# EAGLE schematic driver_board (EAGLE 6.1)

## Sheet 1 of 7: STM1_Mikrokontroler
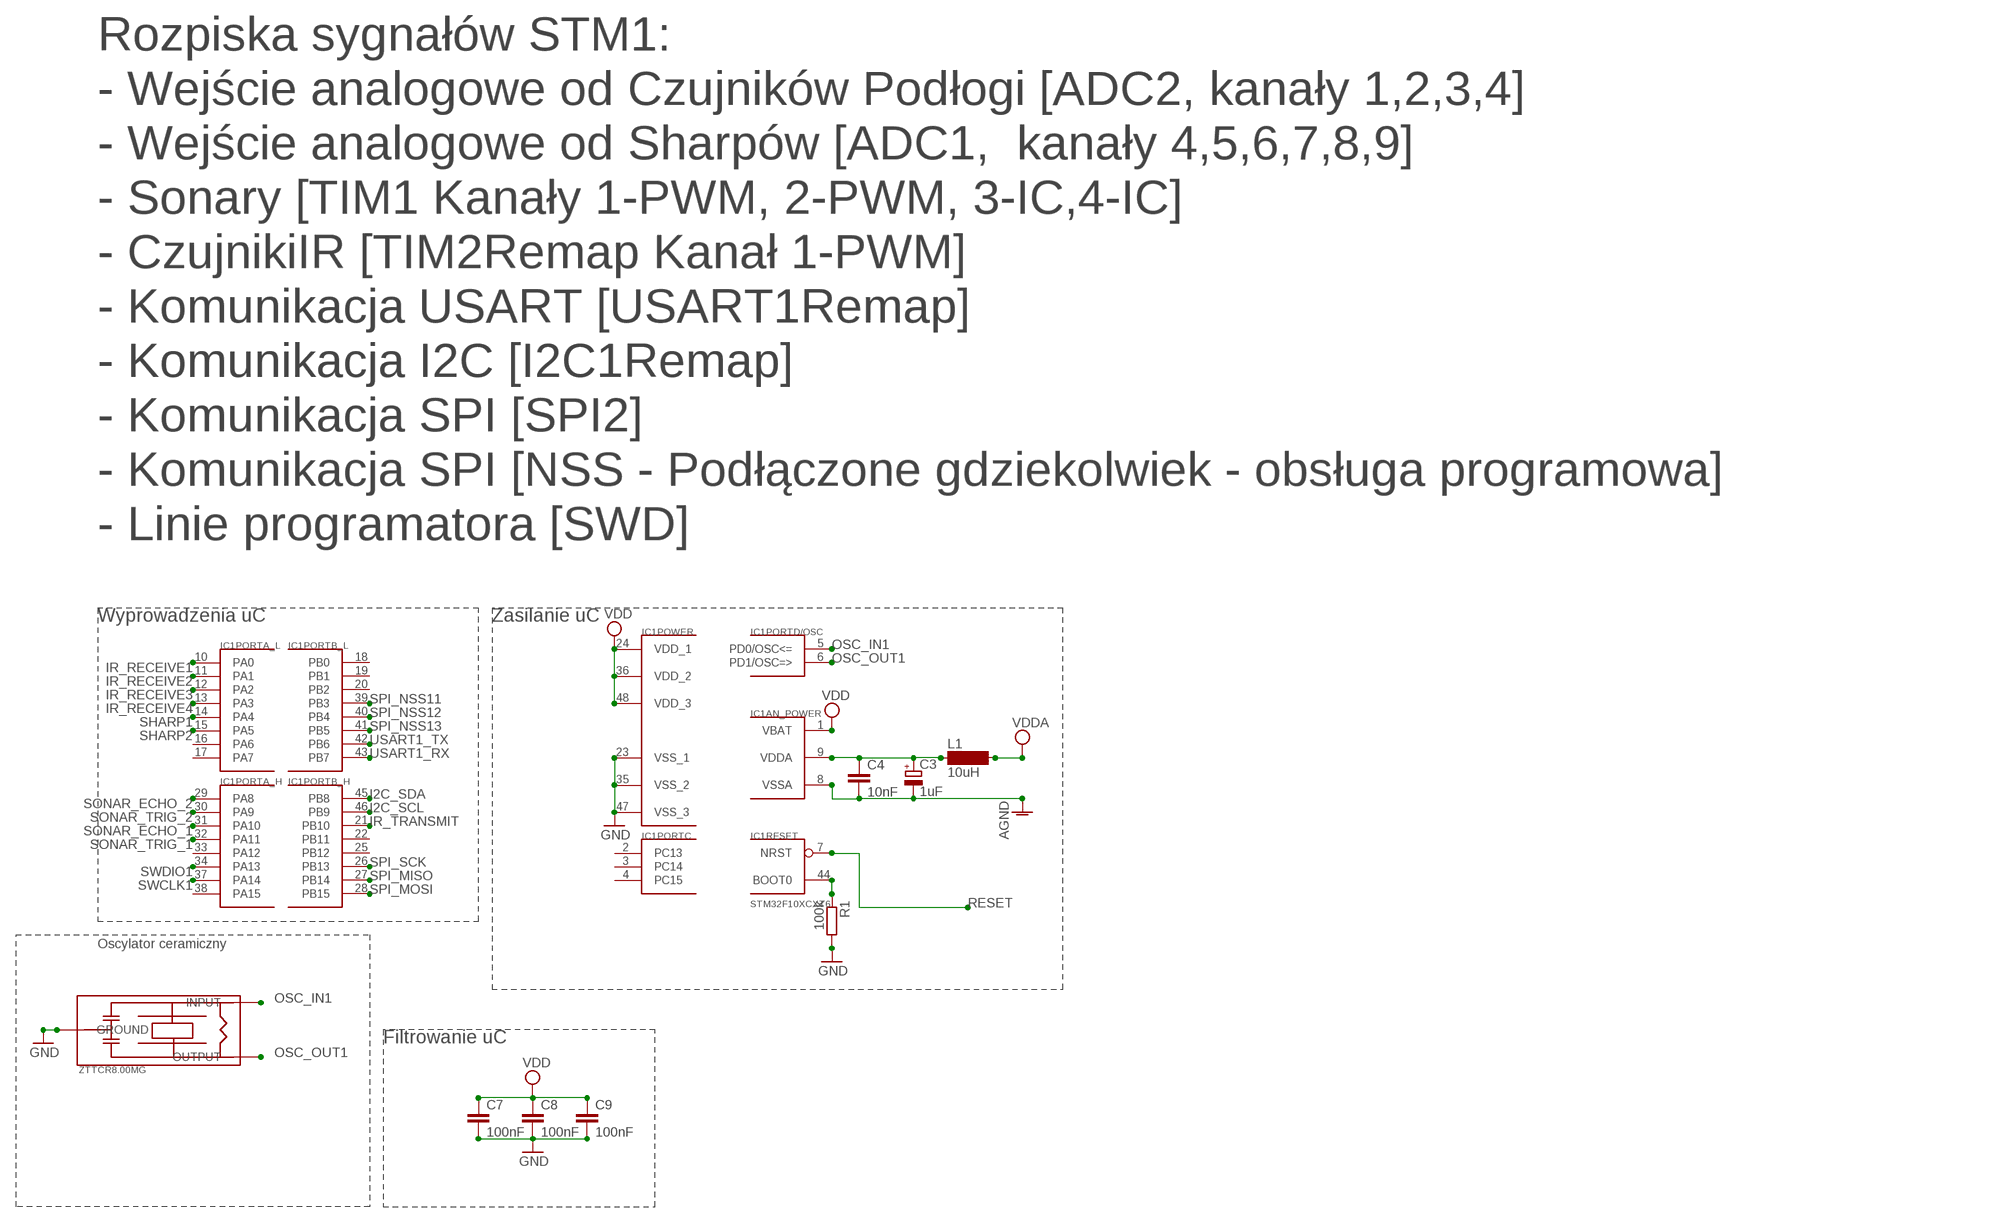
[diagram p0: schematic, sheet 1]

### Parts
C3  1uF  CPOL-EUSMCA  [SMC_A]
C4  10nF  C-EUC0805  [C0805]
C7  100nF  C-EUC0805  [C0805]
C8  100nF  C-EUC0805  [C0805]
C9  100nF  C-EUC0805  [C0805]
IC1  STM32F10XCXT6  [TQFP48]
L1  10uH  SM-1206  [SM-1206]
R1  100k  R-EU_R0805  [R0805]
U$7  ZTTCR8.00MG  [ZTTCR8.00MG]

### Nets
AGND: C3.- C4.2 IC1.8(AN_POWER:VSSA) ; also sheet 3,7
GND: C7.2 C8.2 C9.2 IC1.23(POWER:VSS_1) IC1.35(POWER:VSS_2) IC1.47(POWER:VSS_3) R1.2 U$7.GROUND ; also sheet 2,3,4,5,6,7
I2C_SCL: IC1.46(PORTB_H:PB9) ; also sheet 3,6
I2C_SDA: IC1.45(PORTB_H:PB8) ; also sheet 3,6
IR_RECEIVE1: IC1.10(PORTA_L:PA0) ; also sheet 4
IR_RECEIVE2: IC1.11(PORTA_L:PA1) ; also sheet 4
IR_RECEIVE3: IC1.12(PORTA_L:PA2) ; also sheet 4
IR_RECEIVE4: IC1.13(PORTA_L:PA3) ; also sheet 4
IR_TRANSMIT: IC1.21(PORTB_H:PB10) ; also sheet 4
N$4: IC1.44(RESET:BOOT0) R1.1
N$5: C3.+ C4.1 IC1.9(AN_POWER:VDDA) L1.1
OSC_IN1: IC1.5(PORTD/OSC:PD0/OSC<=) U$7.INPUT
OSC_OUT1: IC1.6(PORTD/OSC:PD1/OSC=>) U$7.OUTPUT
RESET: IC1.7(RESET:NRST) ; also sheet 3
SHARP1: IC1.14(PORTA_L:PA4) ; also sheet 2
SHARP2: IC1.15(PORTA_L:PA5) ; also sheet 2
SONAR_ECHO_1: IC1.31(PORTA_H:PA10) ; also sheet 2
SONAR_ECHO_2: IC1.29(PORTA_H:PA8) ; also sheet 2
SONAR_TRIG_1: IC1.32(PORTA_H:PA11) ; also sheet 2
SONAR_TRIG_2: IC1.30(PORTA_H:PA9) ; also sheet 2
SPI_MISO: IC1.27(PORTB_H:PB14) ; also sheet 3,5,6
SPI_MOSI: IC1.28(PORTB_H:PB15) ; also sheet 3,5,6
SPI_NSS11: IC1.39(PORTB_L:PB3) ; also sheet 5
SPI_NSS12: IC1.40(PORTB_L:PB4) ; also sheet 6
SPI_NSS13: IC1.41(PORTB_L:PB5) ; also sheet 6
SPI_SCK: IC1.26(PORTB_H:PB13) ; also sheet 3,5,6
SWCLK1: IC1.37(PORTA_H:PA14) ; also sheet 7
SWDIO1: IC1.34(PORTA_H:PA13) ; also sheet 7
USART1_RX: IC1.43(PORTB_L:PB7) ; also sheet 6
USART1_TX: IC1.42(PORTB_L:PB6) ; also sheet 6
VDD: C7.1 C8.1 C9.1 IC1.1(AN_POWER:VBAT) IC1.24(POWER:VDD_1) IC1.36(POWER:VDD_2) IC1.48(POWER:VDD_3) ; also sheet 3,4,6,7
VDDA: L1.2 ; also sheet 7
Unconnected: IC1.2(PORTC:PC13) IC1.3(PORTC:PC14) IC1.4(PORTC:PC15) IC1.16(PORTA_L:PA6) IC1.17(PORTA_L:PA7) IC1.18(PORTB_L:PB0) IC1.19(PORTB_L:PB1) IC1.20(PORTB_L:PB2) IC1.22(PORTB_H:PB11) IC1.25(PORTB_H:PB12) IC1.33(PORTA_H:PA12) IC1.38(PORTA_H:PA15)

### Notes on the sheet
- Rozpiska sygnałów STM1:
- - Wejście analogowe od Czujników Podłogi [ADC2, kanały 1,2,3,4]
- - Wejście analogowe od Sharpów [ADC1,  kanały 4,5,6,7,8,9]
- - Sonary [TIM1 Kanały 1-PWM, 2-PWM, 3-IC,4-IC]
- - CzujnikiIR [TIM2Remap Kanał 1-PWM]
- - Komunikacja USART [USART1Remap]
- - Komunikacja I2C [I2C1Remap]
- - Komunikacja SPI [SPI2]
- - Komunikacja SPI [NSS - Podłączone gdziekolwiek - obsługa programowa]
- - Linie programatora [SWD]
- Wyprowadzenia uC | Zasilanie uC
- Oscylator ceramiczny
- Filtrowanie uC

## Sheet 2 of 7: STM1_Sonary
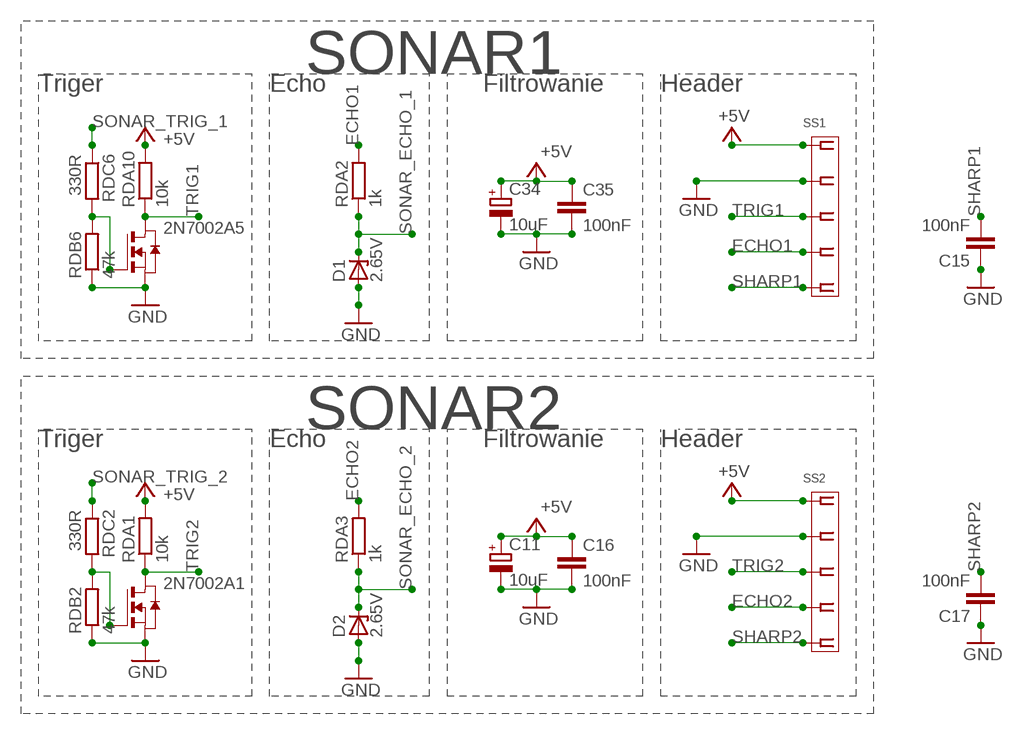
[diagram p1: schematic, sheet 2]

### Parts
2N7002A1  NMOSSOT23  [SOT-23]
2N7002A5  NMOSSOT23  [SOT-23]
C11  10uF  CPOL-EUSMCA  [SMC_A]
C15  100nF  C-EUC0805  [C0805]
C16  100nF  C-EUC0805  [C0805]
C17  100nF  C-EUC0805  [C0805]
C34  10uF  CPOL-EUSMCA  [SMC_A]
C35  100nF  C-EUC0805  [C0805]
D1  2.65V  ZENER-DIODESOD80C  [SOD80C]
D2  2.65V  ZENER-DIODESOD80C  [SOD80C]
RDA1  10k  R-EU_R0805  [R0805]
RDA2  1k  R-EU_R0805  [R0805]
RDA3  1k  R-EU_R0805  [R0805]
RDA10  10k  R-EU_R0805  [R0805]
RDB2  47k  R-EU_R0805  [R0805]
RDB6  47k  R-EU_R0805  [R0805]
RDC2  330R  R-EU_R0805  [R0805]
RDC6  330R  R-EU_R0805  [R0805]
SS1  MOLEX-5268-05  [MOLEX-5268-05]
SS2  MOLEX-5268-05  [MOLEX-5268-05]

### Nets
+5V: C11.+ C16.1 C34.+ C35.1 RDA1.2 RDA10.2 SS1.P$1 SS2.P$1 ; also sheet 3,5,7
ECHO1: RDA2.2 SS1.P$4
ECHO2: RDA3.2 SS2.P$4
GND: 2N7002A1.2(S) 2N7002A5.2(S) C11.- C15.1 C16.2 C17.1 C34.- C35.2 D1.A D2.A RDB2.1 RDB6.1 SS1.P$2 SS2.P$2 ; also sheet 1,3,4,5,6,7
N$2: 2N7002A5.3(G) RDB6.2 RDC6.2
N$9: 2N7002A1.3(G) RDB2.2 RDC2.2
SHARP1: C15.2 SS1.P$5 ; also sheet 1
SHARP2: C17.2 SS2.P$5 ; also sheet 1
SONAR_ECHO_1: D1.C RDA2.1 ; also sheet 1
SONAR_ECHO_2: D2.C RDA3.1 ; also sheet 1
SONAR_TRIG_1: RDC6.1 ; also sheet 1
SONAR_TRIG_2: RDC2.1 ; also sheet 1
TRIG1: 2N7002A5.1(D) RDA10.1 SS1.P$3
TRIG2: 2N7002A1.1(D) RDA1.1 SS2.P$3

### Notes on the sheet
- SONAR1
- Triger | Echo | Filtrowanie | Header
- SONAR2
- Triger | Echo | Filtrowanie | Header

## Sheet 3 of 7: STM2_Mikrokontroler
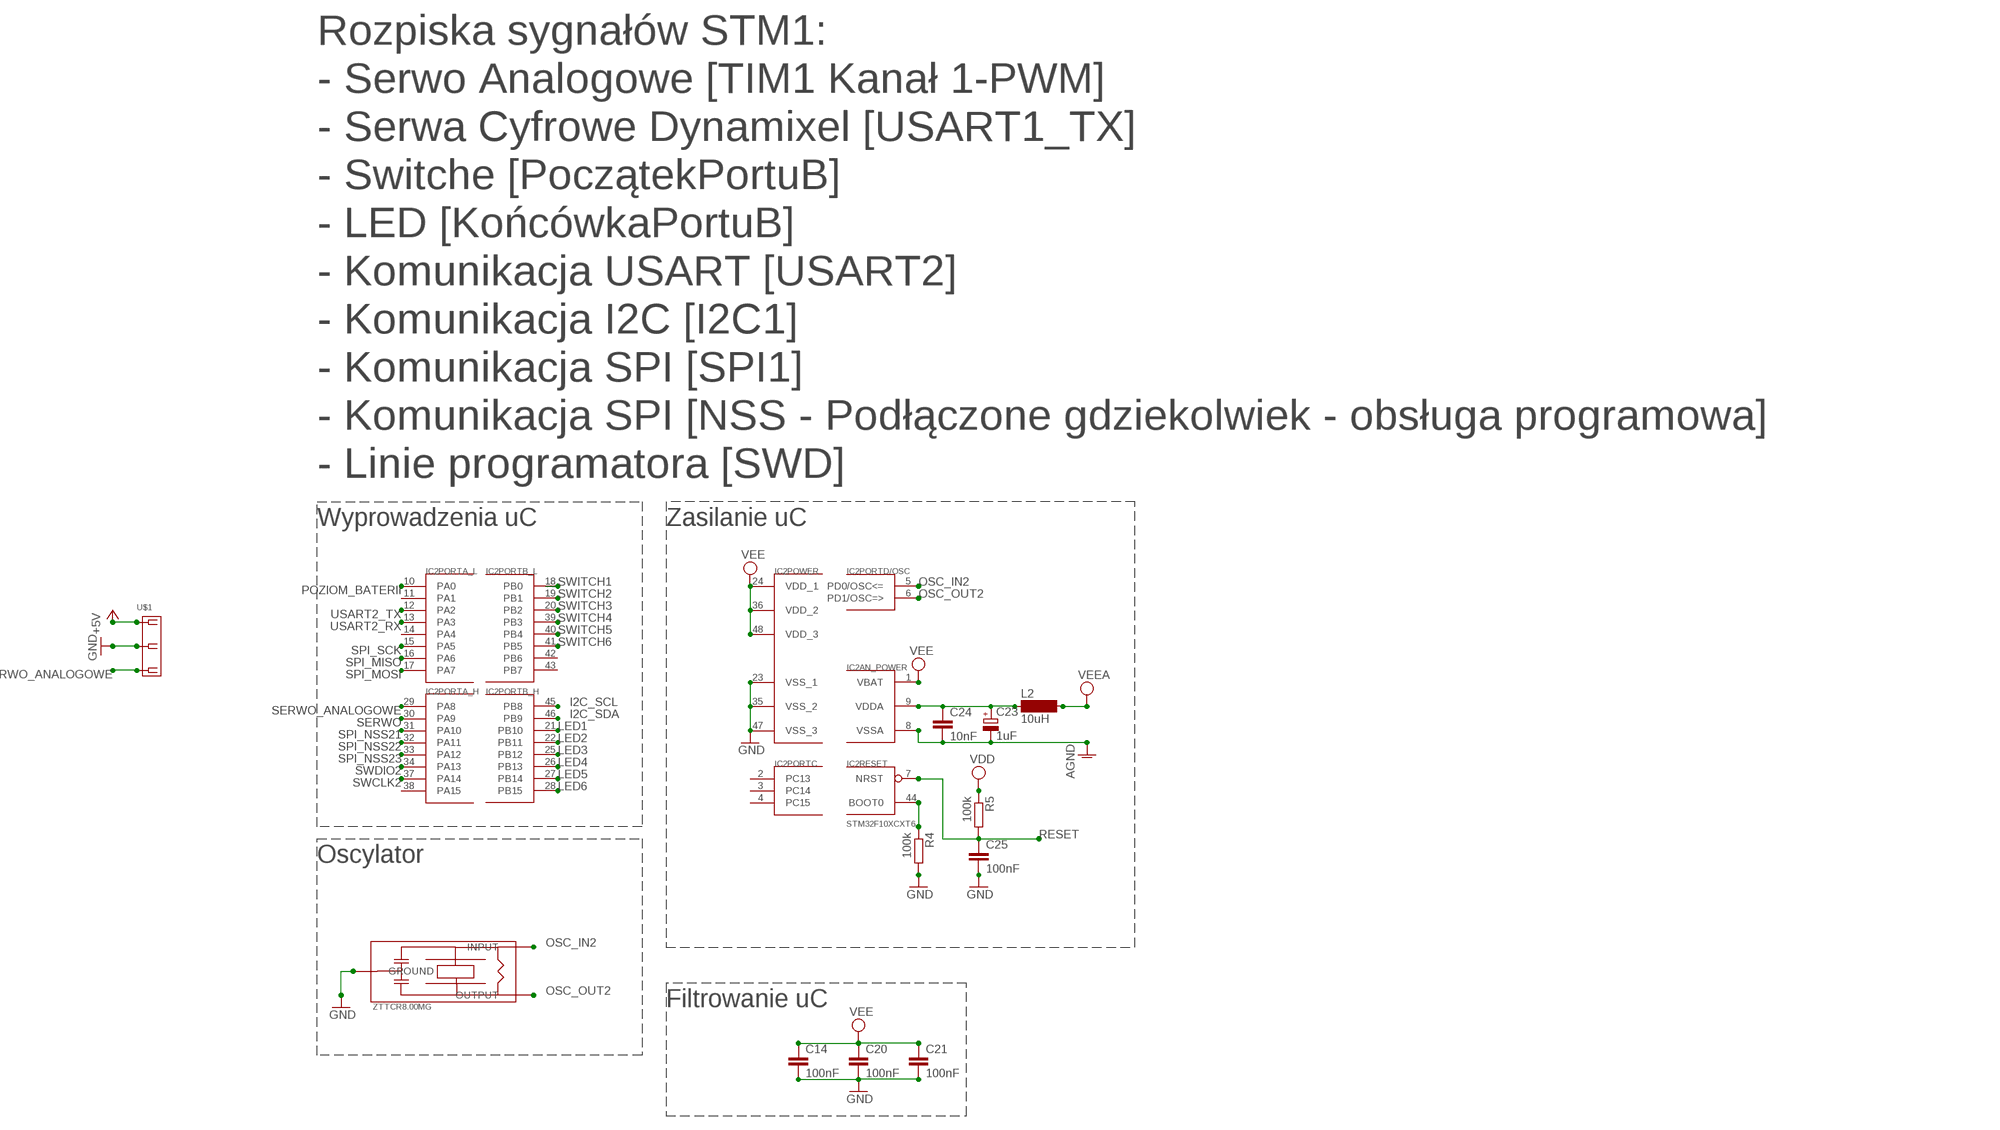
[diagram p2: schematic, sheet 3]

### Parts
C14  100nF  C-EUC0805  [C0805]
C20  100nF  C-EUC0805  [C0805]
C21  100nF  C-EUC0805  [C0805]
C23  1uF  CPOL-EUSMCA  [SMC_A]
C24  10nF  C-EUC0805  [C0805]
C25  100nF  C-EUC0805  [C0805]
IC2  STM32F10XCXT6  [TQFP48]
L2  10uH  SM-1206  [SM-1206]
R4  100k  R-EU_R0805  [R0805]
R5  100k  R-EU_R0805  [R0805]
U$1  MOLEX-5268-03  [MOLEX-5268-03]
U$8  ZTTCR8.00MG  [ZTTCR8.00MG]

### Nets
+5V: U$1.P$1 ; also sheet 2,5,7
AGND: C23.- C24.2 IC2.8(AN_POWER:VSSA) ; also sheet 1,7
GND: C14.2 C20.2 C21.2 C25.2 IC2.23(POWER:VSS_1) IC2.35(POWER:VSS_2) IC2.47(POWER:VSS_3) R4.2 U$1.P$2 U$8.GROUND ; also sheet 1,2,4,5,6,7
I2C_SCL: IC2.45(PORTB_H:PB8) ; also sheet 1,6
I2C_SDA: IC2.46(PORTB_H:PB9) ; also sheet 1,6
LED1: IC2.21(PORTB_H:PB10) ; also sheet 5
LED2: IC2.22(PORTB_H:PB11) ; also sheet 5
LED3: IC2.25(PORTB_H:PB12) ; also sheet 5
LED4: IC2.26(PORTB_H:PB13) ; also sheet 5
LED5: IC2.27(PORTB_H:PB14) ; also sheet 5
LED6: IC2.28(PORTB_H:PB15) ; also sheet 5
N$6: C23.+ C24.1 IC2.9(AN_POWER:VDDA) L2.1
N$7: IC2.44(RESET:BOOT0) R4.1
OSC_IN2: IC2.5(PORTD/OSC:PD0/OSC<=) U$8.INPUT
OSC_OUT2: IC2.6(PORTD/OSC:PD1/OSC=>) U$8.OUTPUT
POZIOM_BATERII: IC2.10(PORTA_L:PA0) ; also sheet 7
RESET: C25.1 IC2.7(RESET:NRST) R5.2 ; also sheet 1
SERWO: IC2.30(PORTA_H:PA9) ; also sheet 5
SERWO_ANALOGOWE: IC2.29(PORTA_H:PA8) U$1.P$3
SPI_MISO: IC2.16(PORTA_L:PA6) ; also sheet 1,5,6
SPI_MOSI: IC2.17(PORTA_L:PA7) ; also sheet 1,5,6
SPI_NSS21: IC2.31(PORTA_H:PA10) ; also sheet 5
SPI_NSS22: IC2.32(PORTA_H:PA11) ; also sheet 6
SPI_NSS23: IC2.33(PORTA_H:PA12) ; also sheet 6
SPI_SCK: IC2.15(PORTA_L:PA5) ; also sheet 1,5,6
SWCLK2: IC2.37(PORTA_H:PA14) ; also sheet 7
SWDIO2: IC2.34(PORTA_H:PA13) ; also sheet 7
SWITCH1: IC2.18(PORTB_L:PB0) ; also sheet 5
SWITCH2: IC2.19(PORTB_L:PB1) ; also sheet 5
SWITCH3: IC2.20(PORTB_L:PB2) ; also sheet 5
SWITCH4: IC2.39(PORTB_L:PB3) ; also sheet 5
SWITCH5: IC2.40(PORTB_L:PB4) ; also sheet 5
SWITCH6: IC2.41(PORTB_L:PB5) ; also sheet 5
USART2_RX: IC2.13(PORTA_L:PA3) ; also sheet 6
USART2_TX: IC2.12(PORTA_L:PA2) ; also sheet 6
VDD: R5.1 ; also sheet 1,4,6,7
VEE: C14.1 C20.1 C21.1 IC2.1(AN_POWER:VBAT) IC2.24(POWER:VDD_1) IC2.36(POWER:VDD_2) IC2.48(POWER:VDD_3) ; also sheet 5,6,7
VEEA: L2.2 ; also sheet 7
Unconnected: IC2.2(PORTC:PC13) IC2.3(PORTC:PC14) IC2.4(PORTC:PC15) IC2.11(PORTA_L:PA1) IC2.14(PORTA_L:PA4) IC2.38(PORTA_H:PA15) IC2.42(PORTB_L:PB6) IC2.43(PORTB_L:PB7)

### Notes on the sheet
- Rozpiska sygnałów STM1:
- - Serwo Analogowe [TIM1 Kanał 1-PWM]
- - Serwa Cyfrowe Dynamixel [USART1_TX]
- - Switche [PoczątekPortuB]
- - LED [KońcówkaPortuB]
- - Komunikacja USART [USART2]
- - Komunikacja I2C [I2C1]
- - Komunikacja SPI [SPI1]
- - Komunikacja SPI [NSS - Podłączone gdziekolwiek - obsługa programowa]
- - Linie programatora [SWD]
- Wyprowadzenia uC | Zasilanie uC
- Oscylator
- Filtrowanie uC

## Sheet 4 of 7: STM1_IR
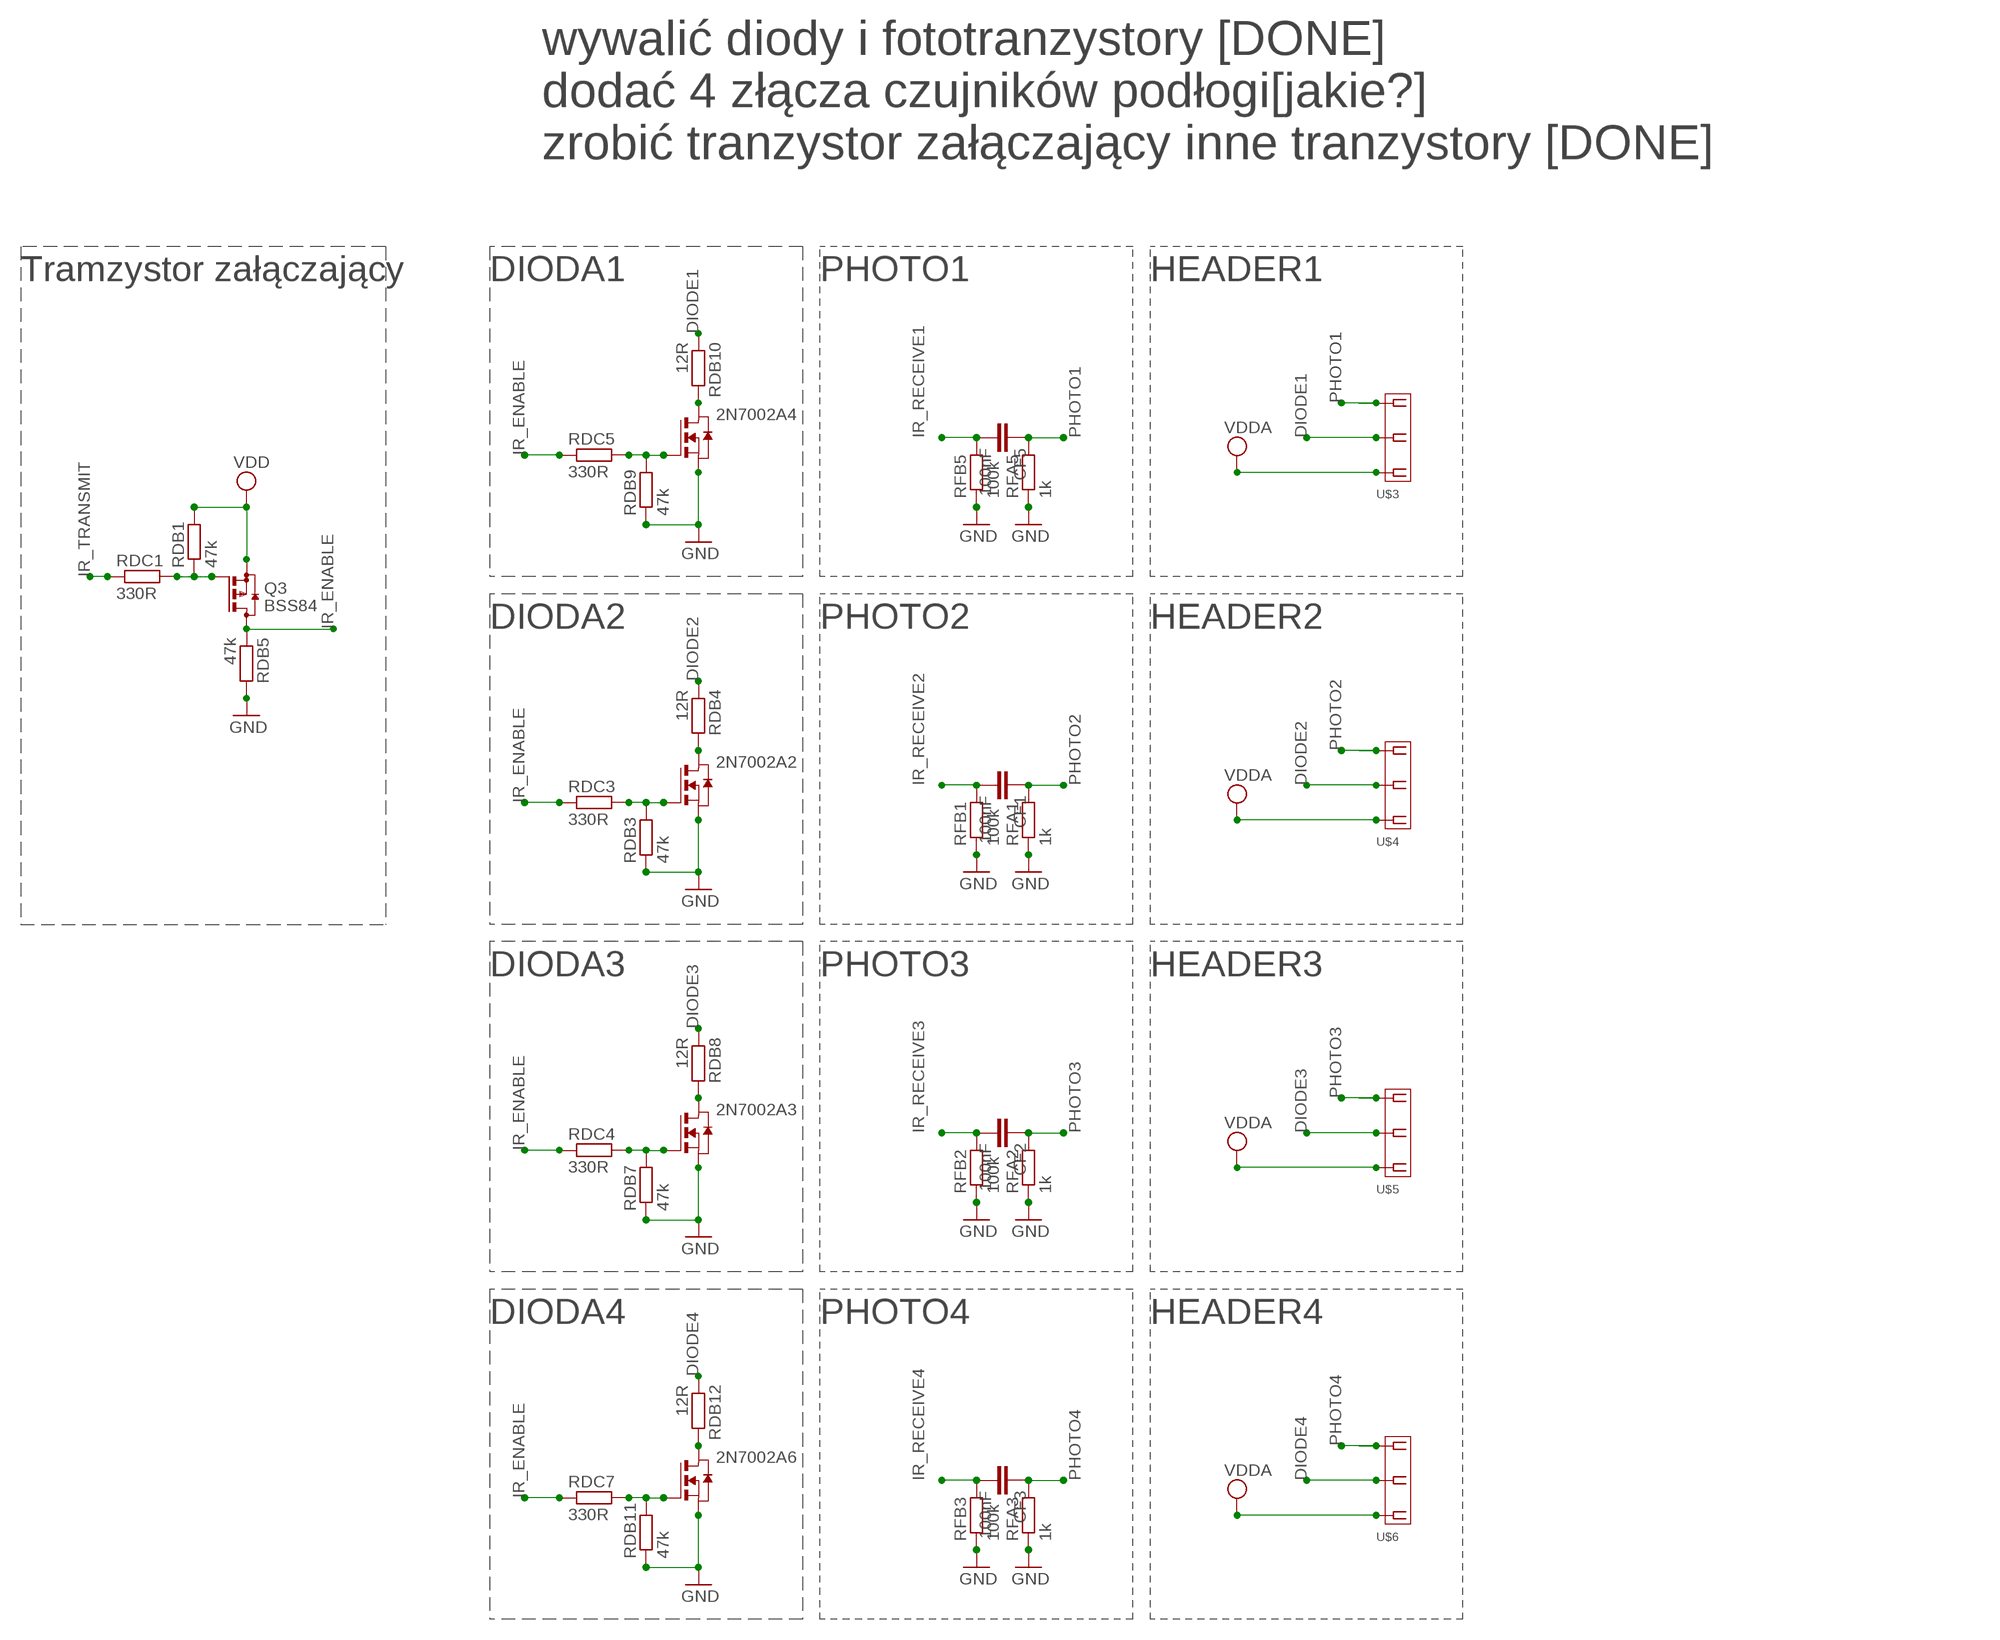
[diagram p3: schematic, sheet 4]

### Parts
2N7002A2  NMOSSOT23  [SOT-23]
2N7002A3  NMOSSOT23  [SOT-23]
2N7002A4  NMOSSOT23  [SOT-23]
2N7002A6  NMOSSOT23  [SOT-23]
CF1  100nF  C-EUC0805  [C0805]
CF2  100nF  C-EUC0805  [C0805]
CF3  100nF  C-EUC0805  [C0805]
CF5  100nF  C-EUC0805  [C0805]
Q3  BSS84  [SOT23]
RDB1  47k  R-EU_R0805  [R0805]
RDB3  47k  R-EU_R0805  [R0805]
RDB4  12R  R-EU_R0805  [R0805]
RDB5  47k  R-EU_R0805  [R0805]
RDB7  47k  R-EU_R0805  [R0805]
RDB8  12R  R-EU_R0805  [R0805]
RDB9  47k  R-EU_R0805  [R0805]
RDB10  12R  R-EU_R0805  [R0805]
RDB11  47k  R-EU_R0805  [R0805]
RDB12  12R  R-EU_R0805  [R0805]
RDC1  330R  R-EU_R0805  [R0805]
RDC3  330R  R-EU_R0805  [R0805]
RDC4  330R  R-EU_R0805  [R0805]
RDC5  330R  R-EU_R0805  [R0805]
RDC7  330R  R-EU_R0805  [R0805]
RFA1  1k  R-EU_R0805  [R0805]
RFA2  1k  R-EU_R0805  [R0805]
RFA3  1k  R-EU_R0805  [R0805]
RFA5  1k  R-EU_R0805  [R0805]
RFB1  100k  R-EU_R0805  [R0805]
RFB2  100k  R-EU_R0805  [R0805]
RFB3  100k  R-EU_R0805  [R0805]
RFB5  100k  R-EU_R0805  [R0805]
U$3  MOLEX-5268-03  [MOLEX-5268-03]
U$4  MOLEX-5268-03  [MOLEX-5268-03]
U$5  MOLEX-5268-03  [MOLEX-5268-03]
U$6  MOLEX-5268-03  [MOLEX-5268-03]

### Nets
DIODE1: RDB10.1 U$3.P$2
DIODE2: RDB4.1 U$4.P$2
DIODE3: RDB8.1 U$5.P$2
DIODE4: RDB12.1 U$6.P$2
GND: 2N7002A2.2(S) 2N7002A3.2(S) 2N7002A4.2(S) 2N7002A6.2(S) RDB3.1 RDB5.2 RDB7.1 RDB9.1 RDB11.1 RFA1.1 RFA2.1 RFA3.1 RFA5.1 RFB1.1 RFB2.1 RFB3.1 RFB5.1 ; also sheet 1,2,3,5,6,7
IR_ENABLE: Q3.3(D) RDB5.1 RDC3.1 RDC4.1 RDC5.1 RDC7.1
IR_RECEIVE1: CF5.2 RFB5.2 ; also sheet 1
IR_RECEIVE2: CF1.2 RFB1.2 ; also sheet 1
IR_RECEIVE3: CF2.2 RFB2.2 ; also sheet 1
IR_RECEIVE4: CF3.2 RFB3.2 ; also sheet 1
IR_TRANSMIT: RDC1.1 ; also sheet 1
N$1: Q3.1(G) RDB1.1 RDC1.2
N$3: 2N7002A2.3(G) RDB3.2 RDC3.2
N$8: 2N7002A2.1(D) RDB4.2
N$10: 2N7002A3.3(G) RDB7.2 RDC4.2
N$11: 2N7002A3.1(D) RDB8.2
N$12: 2N7002A4.3(G) RDB9.2 RDC5.2
N$13: 2N7002A4.1(D) RDB10.2
N$14: 2N7002A6.3(G) RDB11.2 RDC7.2
N$15: 2N7002A6.1(D) RDB12.2
PHOTO1: CF5.1 RFA5.2 U$3.P$3
PHOTO2: CF1.1 RFA1.2 U$4.P$3
PHOTO3: CF2.1 RFA2.2 U$5.P$3
PHOTO4: CF3.1 RFA3.2 U$6.P$3
VDD: Q3.2(S) RDB1.2 U$3.P$1 U$4.P$1 U$5.P$1 U$6.P$1 ; supply symbol labelled VDDA ; also sheet 1,3,6,7

### Notes on the sheet
- wywalić diody i fototranzystory [DONE]
- dodać 4 złącza czujników podłogi[jakie?]
- zrobić tranzystor załączający inne tranzystory [DONE]
- Tramzystor załączający | DIODA1 | PHOTO1 | HEADER1
- DIODA2 | PHOTO2 | HEADER2
- DIODA3 | PHOTO3 | HEADER3
- DIODA4 | PHOTO4 | HEADER4

## Sheet 5 of 7: STM2_Switch+LED+Złącza
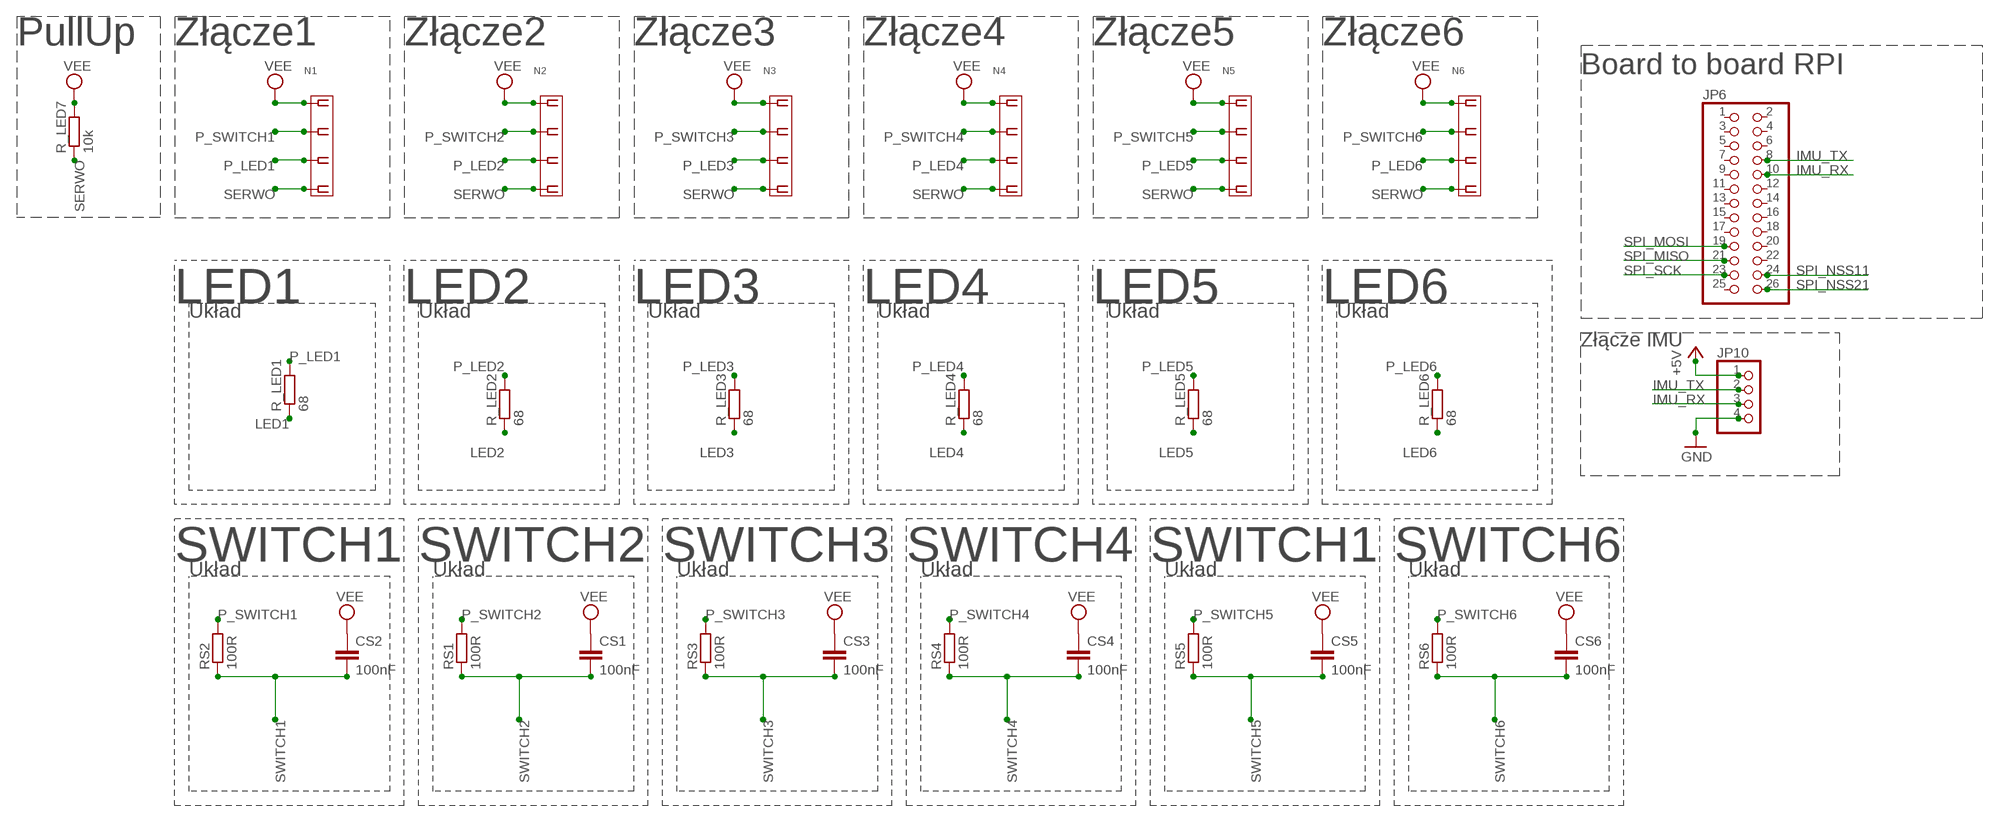
[diagram p4: schematic, sheet 5]

### Parts
CS1  100nF  C-EUC0805  [C0805]
CS2  100nF  C-EUC0805  [C0805]
CS3  100nF  C-EUC0805  [C0805]
CS4  100nF  C-EUC0805  [C0805]
CS5  100nF  C-EUC0805  [C0805]
CS6  100nF  C-EUC0805  [C0805]
JP6  PINHD-2X13  [2X13]
JP10  PINHD-1X4  [1X04]
N1  MOLEX-5268-04  [MOLEX-5268-04]
N2  MOLEX-5268-04  [MOLEX-5268-04]
N3  MOLEX-5268-04  [MOLEX-5268-04]
N4  MOLEX-5268-04  [MOLEX-5268-04]
N5  MOLEX-5268-04  [MOLEX-5268-04]
N6  MOLEX-5268-04  [MOLEX-5268-04]
R_LED1  68  R-EU_R0805  [R0805]
R_LED2  68  R-EU_R0805  [R0805]
R_LED3  68  R-EU_R0805  [R0805]
R_LED4  68  R-EU_R0805  [R0805]
R_LED5  68  R-EU_R0805  [R0805]
R_LED6  68  R-EU_R0805  [R0805]
R_LED7  10k  R-EU_R1206  [R1206]
RS1  100R  R-EU_R0805  [R0805]
RS2  100R  R-EU_R0805  [R0805]
RS3  100R  R-EU_R0805  [R0805]
RS4  100R  R-EU_R0805  [R0805]
RS5  100R  R-EU_R0805  [R0805]
RS6  100R  R-EU_R0805  [R0805]

### Nets
+5V: JP10.1 ; also sheet 2,3,7
GND: JP10.4 ; also sheet 1,2,3,4,6,7
IMU_RX: JP6.10 JP10.3
IMU_TX: JP6.8 JP10.2
LED1: R_LED1.1 ; also sheet 3
LED2: R_LED2.1 ; also sheet 3
LED3: R_LED3.1 ; also sheet 3
LED4: R_LED4.1 ; also sheet 3
LED5: R_LED5.1 ; also sheet 3
LED6: R_LED6.1 ; also sheet 3
P_LED1: N1.P$3 R_LED1.2
P_LED2: N2.P$3 R_LED2.2
P_LED3: N3.P$3 R_LED3.2
P_LED4: N4.P$3 R_LED4.2
P_LED5: N5.P$3 R_LED5.2
P_LED6: N6.P$3 R_LED6.2
P_SWITCH1: N1.P$2 RS2.2
P_SWITCH2: N2.P$2 RS1.2
P_SWITCH3: N3.P$2 RS3.2
P_SWITCH4: N4.P$2 RS4.2
P_SWITCH5: N5.P$2 RS5.2
P_SWITCH6: N6.P$2 RS6.2
SERWO: N1.P$4 N2.P$4 N3.P$4 N4.P$4 N5.P$4 N6.P$4 R_LED7.1 ; also sheet 3
SPI_MISO: JP6.21 ; also sheet 1,3,6
SPI_MOSI: JP6.19 ; also sheet 1,3,6
SPI_NSS11: JP6.24 ; also sheet 1
SPI_NSS21: JP6.26 ; also sheet 3
SPI_SCK: JP6.23 ; also sheet 1,3,6
SWITCH1: CS2.2 RS2.1 ; also sheet 3
SWITCH2: CS1.2 RS1.1 ; also sheet 3
SWITCH3: CS3.2 RS3.1 ; also sheet 3
SWITCH4: CS4.2 RS4.1 ; also sheet 3
SWITCH5: CS5.2 RS5.1 ; also sheet 3
SWITCH6: CS6.2 RS6.1 ; also sheet 3
VEE: CS1.1 CS2.1 CS3.1 CS4.1 CS5.1 CS6.1 N1.P$1 N2.P$1 N3.P$1 N4.P$1 N5.P$1 N6.P$1 R_LED7.2 ; also sheet 3,6,7
Unconnected: JP6.1 JP6.2 JP6.3 JP6.4 JP6.5 JP6.6 JP6.7 JP6.9 JP6.11 JP6.12 JP6.13 JP6.14 JP6.15 JP6.16 JP6.17 JP6.18 JP6.20 JP6.22 JP6.25

### Notes on the sheet
- PullUp | Złącze1 | Złącze2 | Złącze3 | Złącze4 | Złącze5 | Złącze6
- Board to board RPI
- LED1 | LED2 | LED3 | LED4 | LED5 | LED6
- Układ | Układ | Układ | Układ | Układ | Układ
- Złącze IMU
- SWITCH1 | SWITCH2 | SWITCH3 | SWITCH4 | SWITCH1 | SWITCH6
- Układ | Układ | Układ | Układ | Układ | Układ

## Sheet 6 of 7: Interfejsy
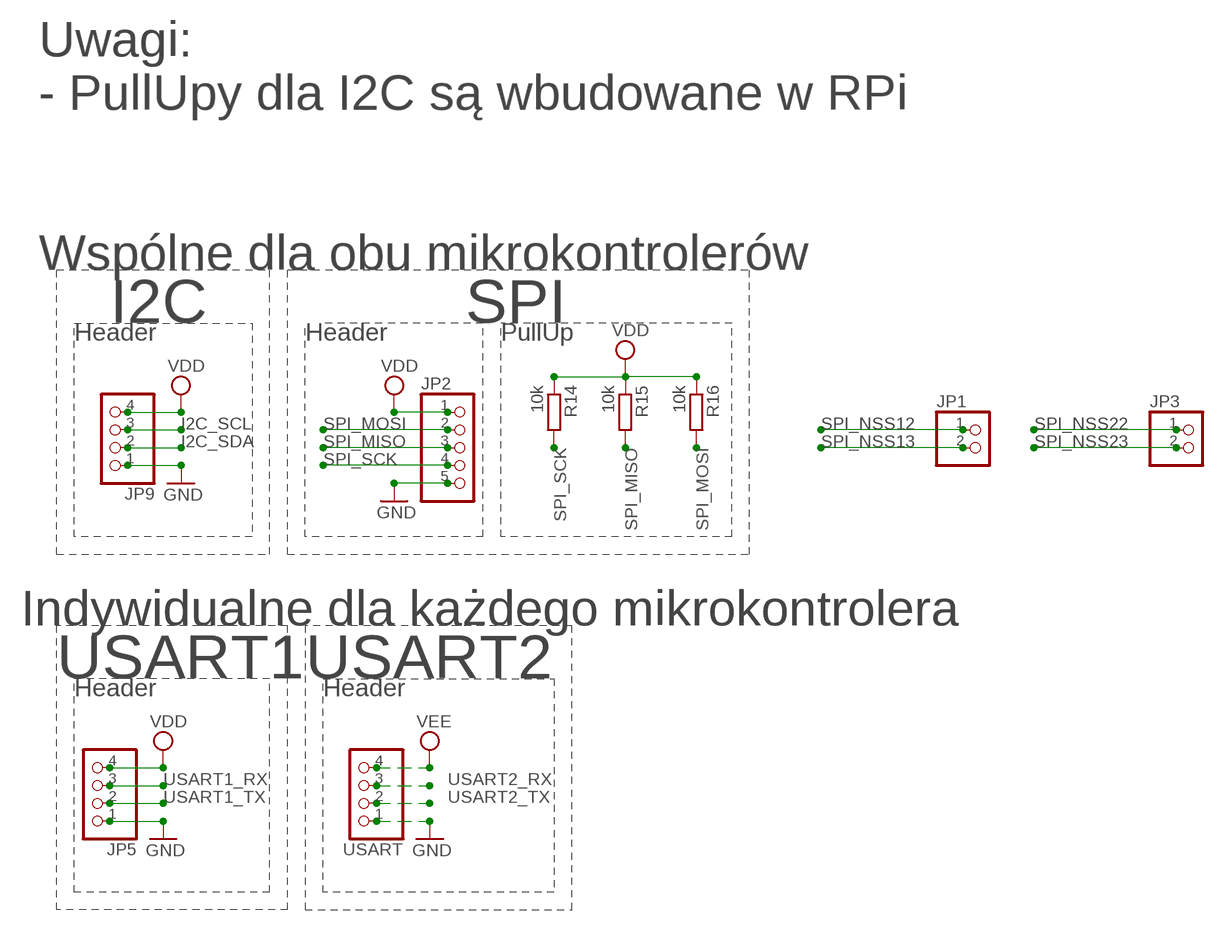
[diagram p5: schematic, sheet 6]

### Parts
JP1  PINHD-1X2  [1X02]
JP2  PINHD-1X5  [1X05]
JP3  PINHD-1X2  [1X02]
JP5  PINHD-1X4  [1X04]
JP9  PINHD-1X4  [1X04]
R14  10k  R-EU_R0805  [R0805]
R15  10k  R-EU_R0805  [R0805]
R16  10k  R-EU_R0805  [R0805]
USART  PINHD-1X4  [1X04]

### Nets
GND: JP2.5 JP5.1 JP9.1 USART.1 ; also sheet 1,2,3,4,5,7
I2C_SCL: JP9.3 ; also sheet 1,3
I2C_SDA: JP9.2 ; also sheet 1,3
SPI_MISO: JP2.3 R15.2 ; also sheet 1,3,5
SPI_MOSI: JP2.2 R16.2 ; also sheet 1,3,5
SPI_NSS12: JP1.1 ; also sheet 1
SPI_NSS13: JP1.2 ; also sheet 1
SPI_NSS22: JP3.1 ; also sheet 3
SPI_NSS23: JP3.2 ; also sheet 3
SPI_SCK: JP2.4 R14.2 ; also sheet 1,3,5
USART1_RX: JP5.3 ; also sheet 1
USART1_TX: JP5.2 ; also sheet 1
USART2_RX: USART.3 ; also sheet 3
USART2_TX: USART.2 ; also sheet 3
VDD: JP2.1 JP5.4 JP9.4 R14.1 R15.1 R16.1 ; also sheet 1,3,4,7
VEE: USART.4 ; also sheet 3,5,7

### Notes on the sheet
- Uwagi:
- - PullUpy dla I2C są wbudowane w RPi
- Wspólne dla obu mikrokontrolerów
- I2C | SPI
- Header | Header | PullUp
- Indywidualne dla każdego mikrokontrolera
- USART1 | USART2
- Header | Header

## Sheet 7 of 7: Zasilanie układu
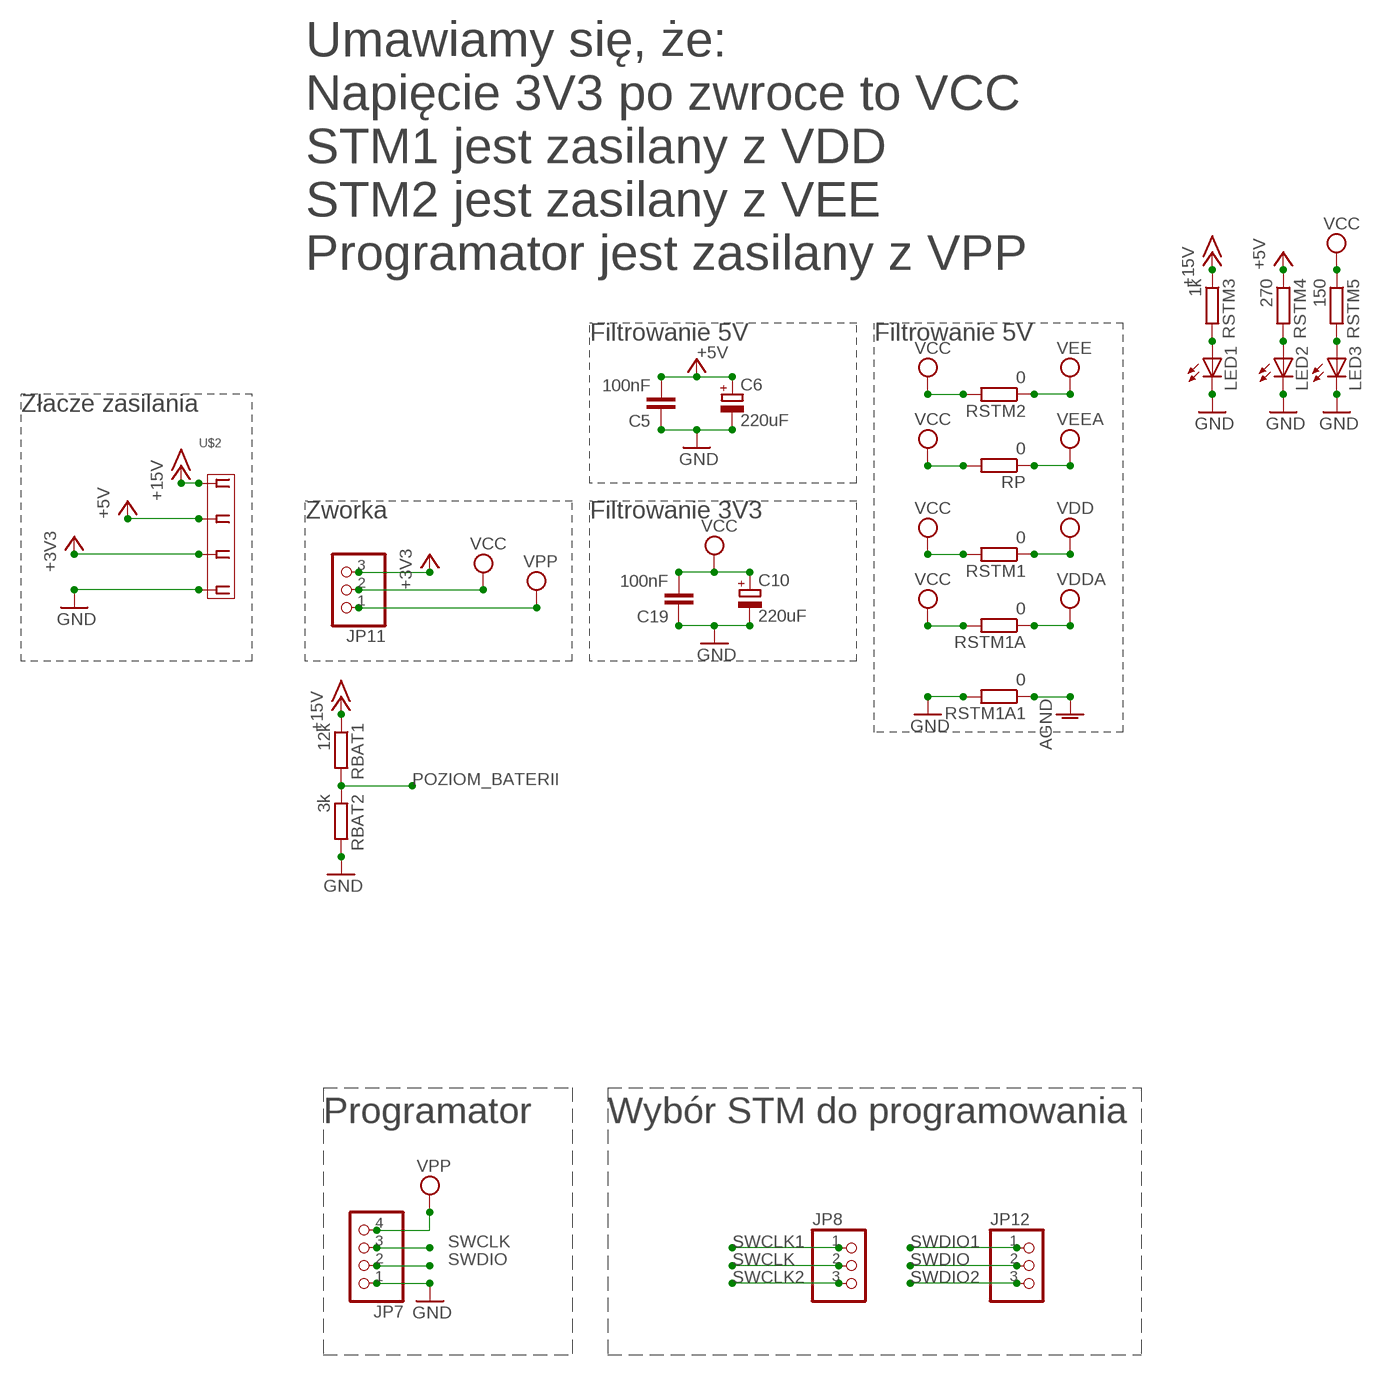
[diagram p6: schematic, sheet 7]

### Parts
C5  100nF  C-EUC0805  [C0805]
C6  220uF  CPOL-EUSMCA  [SMC_A]
C10  220uF  CPOL-EUSMCA  [SMC_A]
C19  100nF  C-EUC0805  [C0805]
JP7  PINHD-1X4  [1X04]
JP8  PINHD-1X3  [1X03]
JP11  PINHD-1X3  [1X03]
JP12  PINHD-1X3  [1X03]
LED1  LEDCHIPLED_0805  [CHIPLED_0805]
LED2  LEDCHIPLED_0805  [CHIPLED_0805]
LED3  LEDCHIPLED_0805  [CHIPLED_0805]
RBAT1  12k  R-EU_R0805  [R0805]
RBAT2  3k  R-EU_R0805  [R0805]
RP  0  R-EU_R0805  [R0805]
RSTM1  0  R-EU_R0805  [R0805]
RSTM1A  0  R-EU_R0805  [R0805]
RSTM1A1  0  R-EU_R0805  [R0805]
RSTM2  0  R-EU_R0805  [R0805]
RSTM3  1k  R-EU_R0805  [R0805]
RSTM4  270  R-EU_R0805  [R0805]
RSTM5  150  R-EU_R0805  [R0805]
U$2  MOLEX-5268-04  [MOLEX-5268-04]

### Nets
+3V3: JP11.3 U$2.P$3
+5V: C5.2 C6.+ RSTM4.1 U$2.P$2 ; also sheet 2,3,5
+15V: RBAT1.1 RSTM3.1 U$2.P$1
AGND: RSTM1A1.1 ; also sheet 1,3
GND: C5.1 C6.- C10.- C19.1 JP7.1 LED1.C LED2.C LED3.C RBAT2.2 RSTM1A1.2 U$2.P$4 ; also sheet 1,2,3,4,5,6
N$16: LED2.A RSTM4.2
N$17: LED3.A RSTM5.2
N$18: LED1.A RSTM3.2
POZIOM_BATERII: RBAT1.2 RBAT2.1 ; also sheet 3
SWCLK: JP7.3 JP8.2
SWCLK1: JP8.1 ; also sheet 1
SWCLK2: JP8.3 ; also sheet 3
SWDIO: JP7.2 JP12.2
SWDIO1: JP12.1 ; also sheet 1
SWDIO2: JP12.3 ; also sheet 3
VCC: C10.+ C19.2 JP11.2 RP.2 RSTM1.2 RSTM1A.2 RSTM2.2 RSTM5.1
VDD: RSTM1.1 ; also sheet 1,3,4,6
VDDA: RSTM1A.1 ; also sheet 1
VEE: RSTM2.1 ; also sheet 3,5,6
VEEA: RP.1 ; also sheet 3
VPP: JP7.4 JP11.1

### Notes on the sheet
- Umawiamy się, że:
- Napięcie 3V3 po zwroce to VCC
- STM1 jest zasilany z VDD
- STM2 jest zasilany z VEE
- Programator jest zasilany z VPP
- Filtrowanie 5V | Filtrowanie 5V
- Złacze zasilania
- Zworka | Filtrowanie 3V3
- Programator | Wybór STM do programowania

## Library data of the parts
2N7002A1-2N7002A6 = zetex:NMOSSOT23: MOS FET; OC_FARNELL: unknown; OC_NEWARK: unknown
C3 C6 C10 C11 C23 C34 = rcl:CPOL-EU: POLARIZED CAPACITOR, European symbol
C4 C5 C7-C9 C14-C17 C19-C21 C24 C25 C35 CF1-CF3 CF5 CS1-CS6 = rcl:C-EU: CAPACITOR, European symbol
D1 D2 = diode:ZENER-DIODE: Z-Diode
IC1 IC2 = stm32:STM32F10XCXT6: ST STM32F101/103 48pin LQFP
JP1 JP3 = pinhead:PINHD-1X2: PIN HEADER
JP2 = pinhead:PINHD-1X5: PIN HEADER
JP5 JP7 JP9 JP10 USART = pinhead:PINHD-1X4: PIN HEADER
JP6 = pinhead:PINHD-2X13: PIN HEADER
JP8 JP11 JP12 = pinhead:PINHD-1X3: PIN HEADER
L1 L2 = inductor-neosid:SM-1206: INDUCTOR SMD chip inductor; OC_FARNELL: unknown; OC_NEWARK: unknown
LED1-LED3 = led:LED: LED OSRAM: - CHIPLED LG R971, LG N971, LY N971, LG Q971, LY Q971, LO R971, LY R971 LH N974, LH R974 LS Q976, LO Q976, LY Q976 LO Q996 - Hyper CHIPLED LW Q18S LB Q993, LB Q99A, LB R99A - SideLED LS A670, LO A670, LY A670, LG A670, LP A670 LB A673, LV A673, LT A673, LW A673 LH A674 LY A675 LS A676, LA A676, LO A676, LY A676, LW A676 LS A679, LY A679, LG A679 - Hyper Micro SIDELED® LS Y876, LA Y876, LO Y876, LY Y876 LT Y87S - SmartLED LW L88C, LW L88S LB L89C, LB L89S, LG L890 LS L89K, LO L89K, LY L89K LS L896, LA L896, LO L896, LY L896 - TOPLED LS T670, LO T670, LY T670, LG T670, LP T670 LSG T670, LSP T670, LSY T670, LOP T670, LYG T670 LG T671, LOG T671, LSG T671 LB T673, LV T673, LT T673, LW T673 LH T674 LS T676, LA T676, LO T676, LY T676, LB T676, LH T676, LSB T676, LW T676 LB T67C, LV T67C, LT T67C, LS T67K, LO T67K, LY T67K, LW E67C LS E67B, LA E67B, LO E67B, LY E67B, LB E67C, LV E67C, LT E67C LW T67C LS T679, LY T679, LG T679 LS T770, LO T770, LY T770, LG T770, LP T770 LB T773, LV T773, LT T773, LW T773 LH T774 LS E675, LA E675, LY E675, LS T675 LS T776, LA T776, LO T776, LY T776, LB T776 LHGB T686 LT T68C, LB T68C - Hyper Mini TOPLED® LB M676 - Mini TOPLED Santana® LG M470 LS M47K, LO M47K, LY M47K Source: http://www.osram.convergy.de LUXEON: - LUMILED® LXK2-PW12-R00, LXK2-PW12-S00, LXK2-PW14-U00, LXK2-PW14-V00 LXK2-PM12-R00, LXK2-PM12-S00, LXK2-PM14-U00 LXK2-PE12-Q00, LXK2-PE12-R00, LXK2-PE12-S00, LXK2-PE14-T00, LXK2-PE14-U00 LXK2-PB12-K00, LXK2-PB12-L00, LXK2-PB12-M00, LXK2-PB14-N00, LXK2-PB14-P00, LXK2-PB14-Q00 LXK2-PR12-L00, LXK2-PR12-M00, LXK2-PR14-Q00, LXK2-PR14-R00 LXK2-PD12-Q00, LXK2-PD12-R00, LXK2-PD12-S00 LXK2-PH12-R00, LXK2-PH12-S00 LXK2-PL12-P00, LXK2-PL12-Q00, LXK2-PL12-R00 Source: www.luxeon.com KINGBRIGHT: KA-3528ASYC Source: www.kingbright.com
N1-N6 U$2 = MOLEX-5268:MOLEX-5268-04
Q3 = transistor-small-signal:BSS84: P-CHANNEL MOS FET
R1 R4 R5 R14-R16 R_LED1-R_LED7 RBAT1 RBAT2 RDA1-RDA3 RDA10 RDB1-RDB12 RDC1-RDC7 RFA1-RFA3 RFA5 RFB1-RFB3 RFB5 RP RS1-RS6 RSTM1 RSTM1A RSTM1A1 RSTM2-RSTM5 = rcl:R-EU_: RESISTOR, European symbol
SS1 SS2 = MOLEX-5268:MOLEX-5268-05
U$1 U$3-U$6 = MOLEX-5268:MOLEX-5268-03
U$7 U$8 = rezonator_smd:ZTTCR8.00MG